# Altium project MZY7-P1.PrjPCB
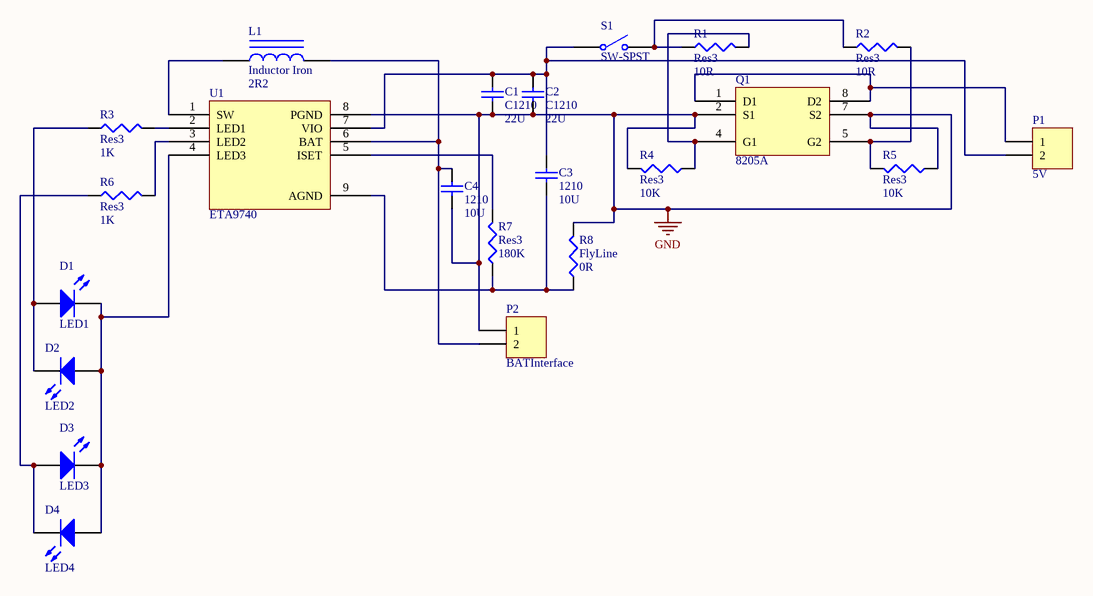
[diagram p0: Sheet.this.SchDoc]
1 sheet, 22 parts. Net scope: global (net labels, ports and power ports of the same name join across sheets).
Board file: PCB.this.PcbDoc

## Sheet Sheet.this.SchDoc
size A4

### Parts
C1  C1210  value 22U  [C1210]
C2  C1210  value 22U  [C1210]
C3  1210  value 10U  [C1210]
C4  1210  value 10U  [C1210]
D1  LED1  [0805D]
D2  LED2  [0805D]
D3  LED3  [0805D]
D4  LED4  [0805D]
L1  Inductor Iron  value 2R2  [L_7x7]
P1  5V  [HDR1X2]
P2  BATInterface  [HDR1X2]
Q1  8205A  [TSSOP8]
R1  Res3  value 10R  [0805]
R2  Res3  value 10R  [0805]
R3  Res3  value 1K  [0805]
R4  Res3  value 10K  [0805]
R5  Res3  value 10K  [0805]
R6  Res3  value 1K  [0805]
R7  Res3  value 180K  [0805]
R8  FlyLine  value 0R  [PFL1]
S1  SW-SPST  [MSS22D18]
U1  ETA9740  [SO-8H]

### Nets
GND: C1.1 C2.1 C4.1 P2.1 Q1.2(S1) Q1.7(S2) R4.2 R5.1 R8.2 U1.8(PGND)
NetC1_2: C1.2 C2.2 C3.2 P1.2 S1.1(COMMON) U1.7(VIO)
NetC3_1: C3.1 R7.1 R8.1 U1.9(AGND)
NetC4_2: C4.2 L1.2 P2.2 U1.6(BAT)
NetD1_1: D1.1(A) D2.2(K) R3.1
NetD1_2: D1.2(K) D2.1(A) D3.2(K) D4.1(A) U1.4(LED3)
NetD3_1: D3.1(A) D4.2(K) R6.1
NetL1_1: L1.1 U1.1(SW)
NetP1_1: P1.1 Q1.1(D1) Q1.8(D2)
NetQ1_4: Q1.4(G1) R1.2 R4.1
NetQ1_5: Q1.5(G2) R2.2 R5.2
NetR1_1: R1.1 R2.1 S1.2(NO)
NetR3_2: R3.2 U1.2(LED1)
NetR6_2: R6.2 U1.3(LED2)
NetR7_2: R7.2 U1.5(ISET)

### Library data of the parts
C1-C4 = Cap: Capacitor; Published: 8-Jun-2000; LatestRevisionDate: 17-Jul-2002; LatestRevisionNote: Re-released for DXP Platform.; PackageReference: RAD-0.3; Publisher: Altium Limited; PackageDescription: Radial Cap, Thru-Hole; 2 Leads; 0.3 in Pin Spacing
D1-D4 = LED2: Typical RED, GREEN, YELLOW, AMBER GaAs LED; Published: 8-Jun-2000; LatestRevisionDate: 17-Jul-2002; LatestRevisionNote: Re-released for DXP Platform.; PackageVersion: Feb-2002; PackageReference: 3.2X1.6X1.1; Publisher: Altium Limited; PackageDescription: SM LED; 2 Flat Leads
L1 = Inductor Iron: Magnetic-Core Inductor; Published: 24-Mar-1999; LatestRevisionDate: 17-Jul-2002; LatestRevisionNote: Re-released for DXP Platform.; PackageReference: AXIAL-0.9; Publisher: Altium Limited; PackageDescription: Axial Device, Thru-Hole; 2 Leads; 0.9 in Pin Spacing
P1 = Header 2: Header, 2-Pin; LatestRevisionDate: 17-Jul-2002; LatestRevisionNote: Re-released for DXP Platform.; Publisher: Altium Limited
P2 = Header 2H: Header, 2-Pin, Right Angle; LatestRevisionDate: 17-Jul-2002; LatestRevisionNote: Re-released for DXP Platform.; Publisher: Altium Limited
R1-R7 = Res3: Resistor; Published: 8-Jun-2000; LatestRevisionDate: 29-May-2009; LatestRevisionNote: IPC-7351 Footprint Added.; PackageReference: J1-0603; Publisher: Altium Limited; PackageDescription: Chip Resistor
R8 = Res3: JP; Published: 8-Jun-2000; LatestRevisionDate: 29-May-2009; LatestRevisionNote: IPC-7351 Footprint Added.; PackageReference: J1-0603; Publisher: Altium Limited; PackageDescription: Chip Resistor
S1 = SW-SPST: Single-Pole, Single-Throw Switch; Published: 24-Mar-1999; LatestRevisionDate: 17-Jul-2002; LatestRevisionNote: Re-released for DXP Platform.; PackageReference: SPST-2; Publisher: Altium Limited; PackageDescription: Switch; 2 Leads